# Altium schematic sheet MEMS Resonator.SchDoc
size 381 x 279 mm; SheetNumber: 3; SheetTotal: 4
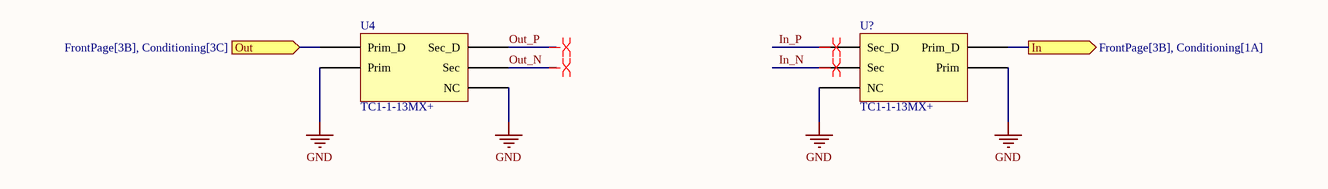
[diagram p0: MEMS Resonator.SchDoc]

## Parts
U4  TC1-1-13MX+  [TC1-1-13MX+]
U?  TC1-1-13MX+  [TC1-1-13MX+]

## Ports
In (out, see FrontPage[3B], Conditioning[1A]), Out (in, see FrontPage[3B], Conditioning[3C])

## Nets
GND: U4.2(NC) U4.4(Prim) U?.2(NC) U?.4(Prim)
In: U?.6(Prim_D) ; port In
In_N: U?.3(Sec)
In_P: U?.1(Sec_D)
Out: U4.6(Prim_D) ; port Out
Out_N: U4.3(Sec)
Out_P: U4.1(Sec_D)

## Layout directives
differential pair: In_N, In_P, Out_N, Out_P

## Notes on the sheet
- Project:
- File:
- Date:
- Designed By :
- © COPYRIGHT 2024 École de Technologie Supérieure
- Revision:
- Sheet
- of
- 1100 Rue Notre-Dame Ouest, Montréal, QC H3C 1K3

## Library data of the parts
U4 U? = TC1-1-13MX+: 1:1 CORE & WIRE TRANSFORMER, 4.5